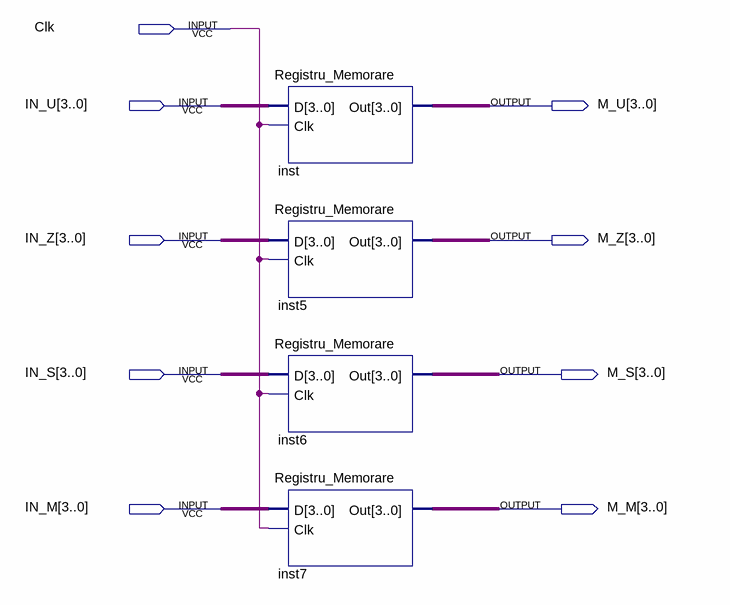
[diagram p0: schematic sheet]
// Quartus schematic Bloc_Memorare.bdf as structural Verilog: 4 symbols, 9 pins
module Bloc_Memorare (
  input  Clk,
  input  [3:0] IN_U,
  input  [3:0] IN_Z,
  input  [3:0] IN_S,
  input  [3:0] IN_M,
  output [3:0] M_U,
  output [3:0] M_Z,
  output [3:0] M_S,
  output [3:0] M_M
);

  Registru_Memorare inst (.D(IN_U), .Clk(Clk), .Out(M_U));
  Registru_Memorare inst5 (.D(IN_Z), .Clk(Clk), .Out(M_Z));
  Registru_Memorare inst6 (.D(IN_S), .Clk(Clk), .Out(M_S));
  Registru_Memorare inst7 (.D(IN_M), .Clk(Clk), .Out(M_M));
endmodule
